# Altium project Temperature_Measurement_Device.PrjPCB
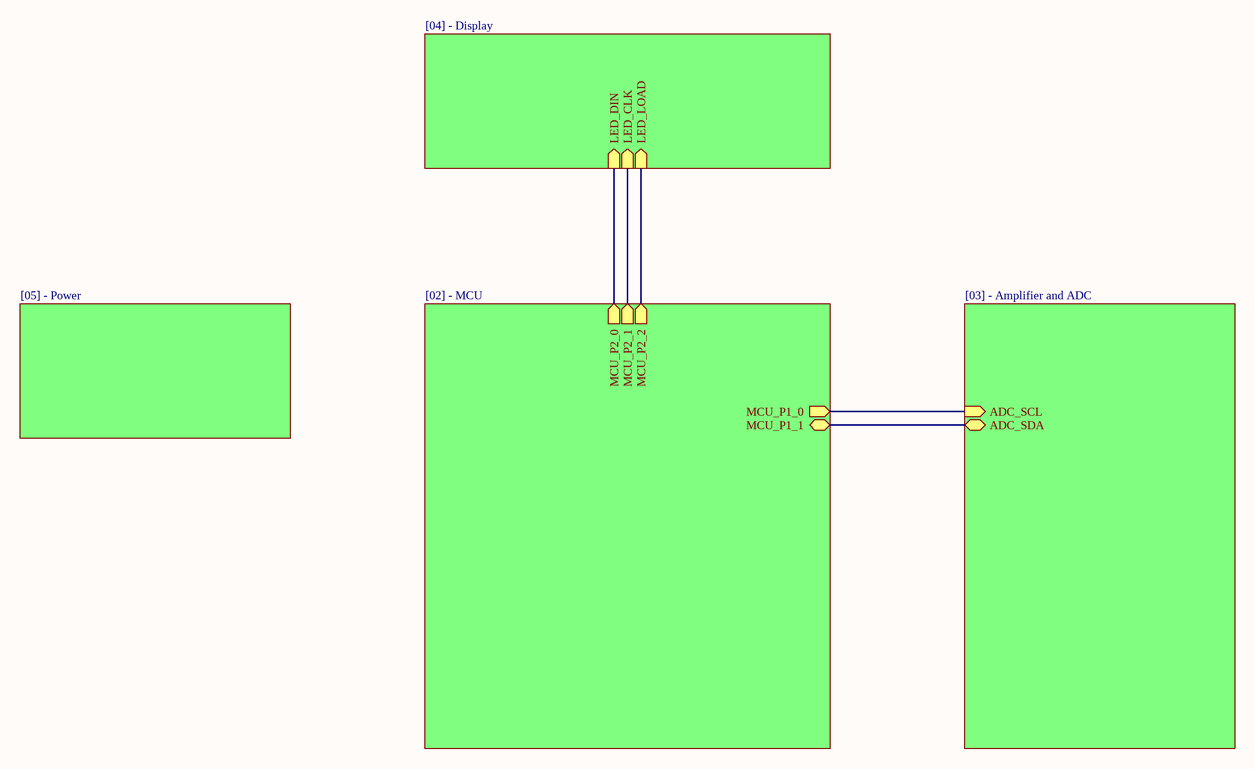
[diagram p0: [01] - SheetConnector.SchDoc]
5 sheets, 64 parts. Net scope: hierarchical (ports join the sheet entries above them; power ports are global).
Board file: Temperature_Measurement_Device.PcbDoc
Sheets:
  [01] - SheetConnector.SchDoc
    4 = [05] - Power.SchDoc
    2 = [02] - MCU.SchDoc
    1 = [04] - Display.SchDoc
    3 = [03] - Amplifier and ADC.SchDoc

## Sheet [01] - SheetConnector.SchDoc: =ProjectName
size A4; CheckedBy: Ven; Author: Ven; CompanyName: HUST; Revision: V.1.0

### Sub-sheets
1 = [04] - Display: LED_DIN (in), LED_CLK (in), LED_LOAD (in)
2 = [02] - MCU: MCU_P2_1 (out), MCU_P2_0 (out), MCU_P2_2 (out), MCU_P1_0 (out), MCU_P1_1 (bidir)
3 = [03] - Amplifier and ADC: ADC_SCL (in), ADC_SDA (bidir)
4 = [05] - Power: no entries

### Nets
NetIC1_1: sheet 2/MCU_P1_0, sheet 3/ADC_SCL
NetIC1_2: sheet 2/MCU_P1_1, sheet 3/ADC_SDA
NetIC1_21: sheet 2/MCU_P2_0, sheet 1/LED_DIN
NetIC1_22: sheet 2/MCU_P2_1, sheet 1/LED_CLK
NetIC1_23: sheet 2/MCU_P2_2, sheet 1/LED_LOAD

### Notes on the sheet
- Project:
- Page Contents:
- Size:
- Date:
- A4
- Checked by:
- Time:
- Revision:
- Sheet
- of
- File:

## Sheet [05] - Power.SchDoc: =ProjectName
size A4; CheckedBy: Ven; Author: Ven; CompanyName: HUST; Revision: V.1.0
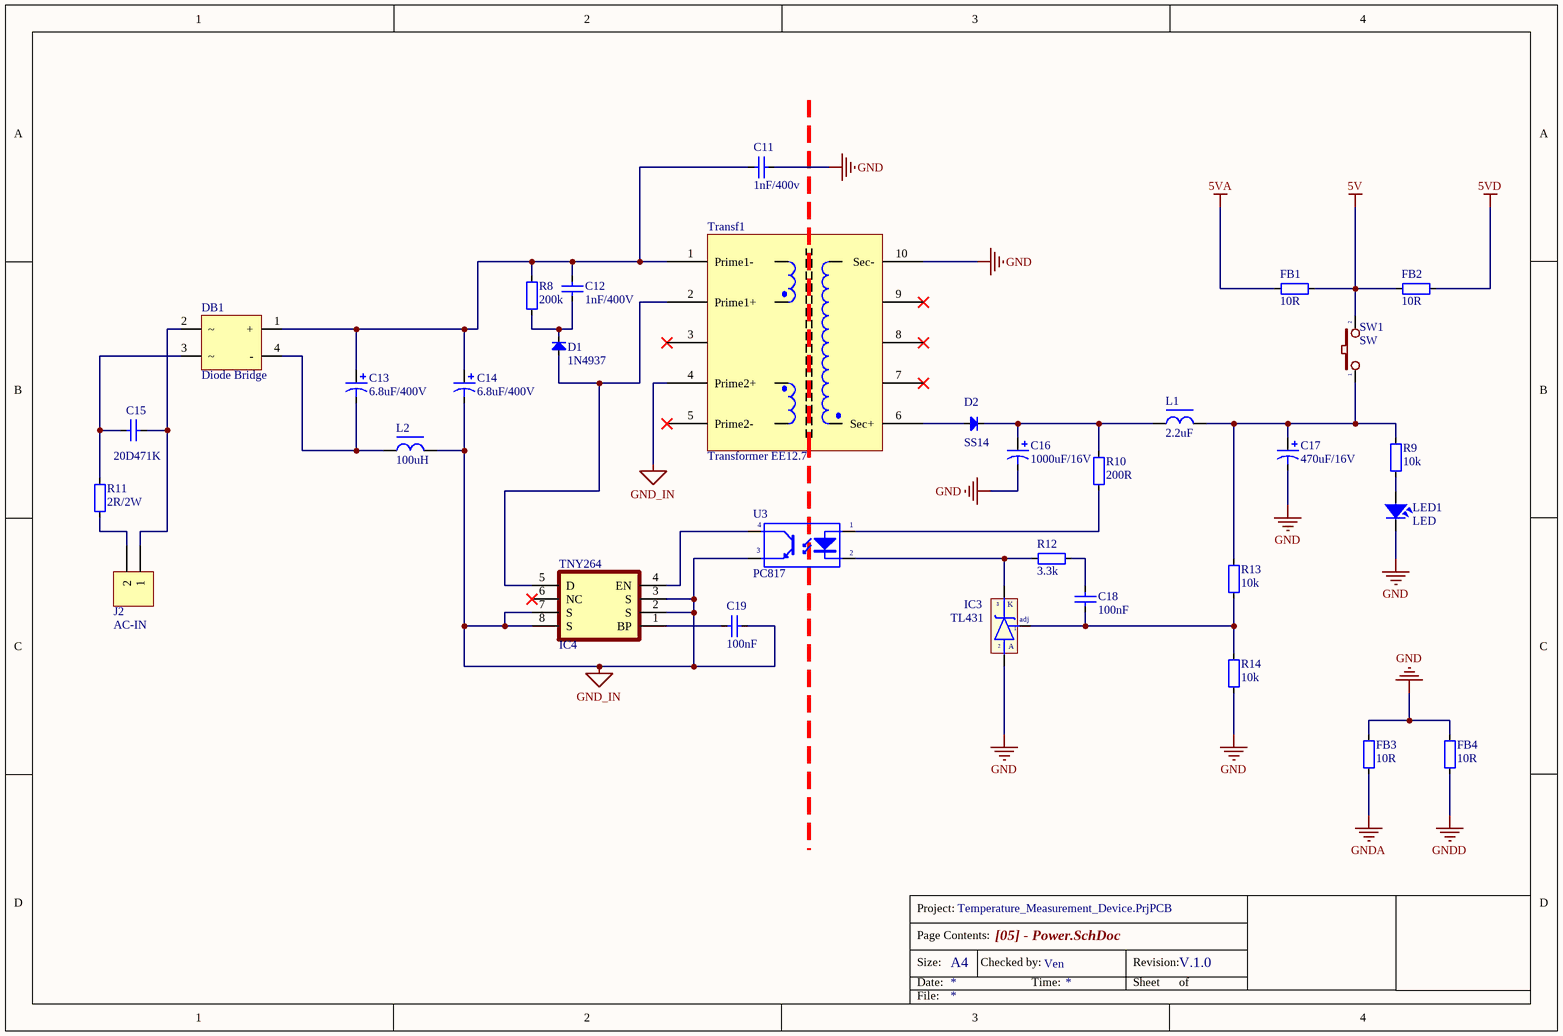
[diagram p1: [05] - Power.SchDoc]

### Parts
C11  1nF/400v  [103/2KV]
C12  1nF/400V  [103/2KV]
C13  6.8uF/400V  [C8mm]
C14  6.8uF/400V  [C8mm]
C15  20D471K  [103/2KV]
C16  1000uF/16V  [C8mm]
C17  470uF/16V  [C8mm]
C18  100nF  [CAP_0805]
C19  100nF  [CAP_0805]
D1  1N4937  [DIO-1AN]
D2  SS14  [DO-214AC(SMA)]
DB1  Diode Bridge  [DB207S]
FB1  10R  [RES-SMD-0805]
FB2  10R  [RES-SMD-0805]
FB3  10R  [RES-SMD-0805]
FB4  10R  [RES-SMD-0805]
IC3  TL431  [qto-92]
IC4  TNY264  [DIP8]
J2  AC-IN  [KF2-5.08]
L1  2.2uF  [L-SMD-M-7.3x4.5]
L2  100uH  [L-DIP-M-9.5x6]
LED1  LED  [LED-0805-Red]
R8  200k  [RES-1/4WD]
R9  10k  [RES-SMD-0805]
R10  200R  [RES-SMD-0805]
R11  2R/2W  [RES-1WD]
R12  3.3k  [RES-SMD-0805]
R13  10k  [RES-SMD-0805]
R14  10k  [RES-SMD-0805]
SW1  SW  [SW2]
Transf1  Transformer EE12.7  [Transformer EE12.7]
U3  PC817  [DIP4/W0.3]

### Nets
5V: FB1.2 FB2.1 SW1.2
5VA: FB1.1
5VD: FB2.2
GND: C11.1 C16.2 C17.2 FB3.2 FB4.2 IC3.2(A) LED1.2 R14.2 Transf1.10(Sec-)
GND_IN: C14.2 C19.1 IC4.2(S) IC4.3(S) IC4.7(S) IC4.8(S) L2.2 Transf1.4(Prime2+) U3.3(E)
GNDA: FB3.1
GNDD: FB4.1
NetC11_2: C11.2 C12.1 C13.1 C14.1 DB1.1(+) R8.2 Transf1.1(Prime1-)
NetC12_2: C12.2 D1.2(K) R8.1
NetC13_2: C13.2 DB1.4(-) L2.1
NetC15_1: C15.1 DB1.2 J2.1
NetC15_2: C15.2 DB1.3 R11.1
NetC16_1: C16.1 D2.2(K) L1.1 R10.1
NetC17_1: C17.1 L1.2 R9.1 R13.1 SW1.1
NetC18_1: C18.1 IC3.1(adj) R13.2 R14.1
NetC18_2: C18.2 R12.2
NetC19_2: C19.2 IC4.1(BP)
NetD1_1: D1.1(A) IC4.5(D) Transf1.2(Prime1+)
NetD2_1: D2.1(A) Transf1.6(Sec+)
NetIC3_3: IC3.3(K) R12.1 U3.2(K)
NetIC4_4: IC4.4(EN) U3.4(C)
NetJ2_2: J2.2 R11.2
NetLED1_1: LED1.1 R9.2
NetR10_2: R10.2 U3.1(A)

Not connected (* = marked no-connect by the designer): IC4 6(NC)*; Transf1 3* 5(Prime2-)* 7* 8* 9*

### Notes on the sheet
- Project:
- Page Contents:
- Size:
- Date:
- A4
- Checked by:
- Time:
- Revision:
- Sheet
- of
- File:

### Library data of the parts
C11 C12 = Cap2KV: CAP CERAMIC; Published: 8-Jun-2000; LatestRevisionDate: 17-Jul-2002; LatestRevisionNote: Re-released for DXP Platform.; PackageReference: RAD-0.3; Publisher: Altium Limited
C13 C14 C16 C17 = Cap Pol: Polarized Capacitor (Axial); Published: 8-Jun-2000; LatestRevisionDate: 17-Jul-2002; LatestRevisionNote: Re-released for DXP Platform.; PackageReference: POLAR0.8; Publisher: Altium Limited
C15 = Cap2KV: Varistor; Published: 8-Jun-2000; LatestRevisionDate: 17-Jul-2002; LatestRevisionNote: Re-released for DXP Platform.; PackageReference: RAD-0.3; Publisher: Altium Limited
C18 C19 = CapSMD: Capacitor; Value: 33p; Published: 8-Jun-2000; LatestRevisionDate: 17-Jul-2002; LatestRevisionNote: Re-released for DXP Platform.; PackageReference: RAD-0.3; Publisher: Altium Limited
D1 = Diode SMD: Diode Schottky / 1N4937; Code - JEDEC: DO-214-AB; Value: 1N5007; Published: 8-Jun-2000; Revision: July-2002: Re-released for DXP Platform.; Publisher: Altium Limited
D2 = Diode SMD: Diode Schottky / 1N5819; Code - JEDEC: DO-214-AB; Value: 1N5007; Published: 8-Jun-2000; Revision: July-2002: Re-released for DXP Platform.; Publisher: Altium Limited
DB1 = Diode Bridge Flate
FB1-FB4 = Resistor - SMD: Ferrit Bead; Manufacturer: Generic Components; Class: Passive; Published: 08/06/2000; Publisher: Altium Hobart Technology Centre
IC3 = TL431: Programmable Shunt Regulator; Value: TL431
IC4 = TNY264: Enhanced, Energy Efficient, Low Power Off-line Switcher
J2 = KF2: Manufacturer: Würth Elektronik eiSos GmbH; partNo: 691103110002; ComponentLink1 Description: Manufacturer; ComponentLink2 Description: Datasheet; NoPins: 2; Created Date: 29 October 2013; ComponentLink1URL: http://www.we-online.com; ComponentLink2URL: http://katalog.we-online.de/em/datasheet/6911031100xx.pdf; Created by: Karrer Zheng
L1 L2 = L-DIP-1: Inductor; Value: 150 mH
LED1 = LED: LED Single colour Green and Red; Value: LED 3 ly Single Colour
R8-R14 = Resistor - SMD: Resistor; Manufacturer: Generic Components; Class: Passive; Published: 08/06/2000; Publisher: Altium Hobart Technology Centre
SW1 = SW2: Switch button 2 pin; Value: SW chip 2 pin
Transf1 = Tranformer EE16
U3 = PC817: Single Opto; Value: PC817

## Sheet [02] - MCU.SchDoc: =ProjectName
size A4; CheckedBy: Ven; Author: Ven; CompanyName: HUST; Revision: V.1.0
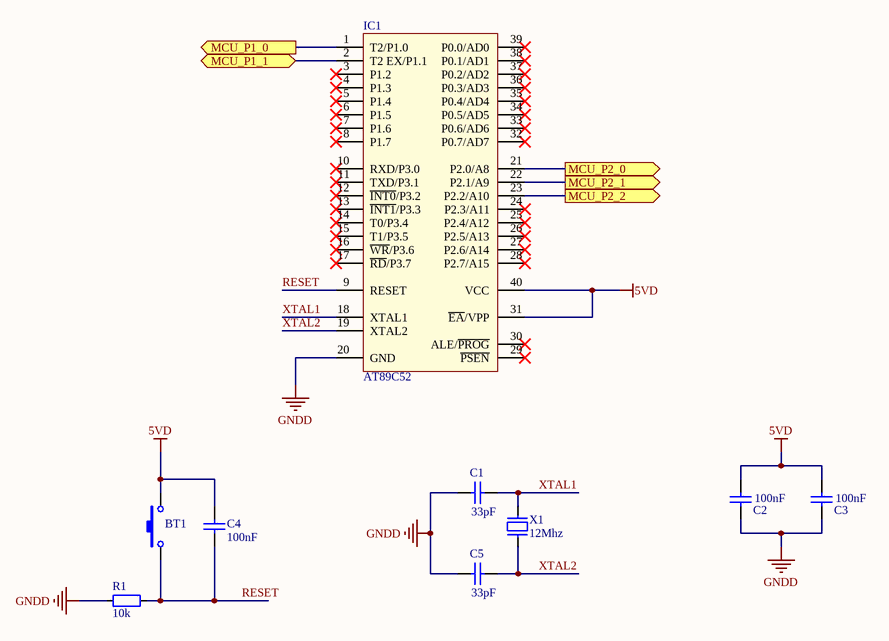
[diagram p2: [02] - MCU.SchDoc]

### Parts
BT1  SW2  [SW 3x2x4]  (value not drawn)
C1  33pF  [CAP_0805]
C2  100nF  [CAP_0805]
C3  100nF  [CAP_0805]
C4  100nF  [CAP_0805]
C5  33pF  [CAP_0805]
IC1  AT89C52  [DIP40/W0.6]
R1  10k  [RES-SMD-0805]
X1  12Mhz  [XT2]

### Ports
MCU_P1_0 (out), MCU_P1_1 (bidir), MCU_P2_0 (out), MCU_P2_1 (out), MCU_P2_2 (out)

### Nets
5VD: BT1.2 C2.2 C3.2 C4.2 IC1.31(~{EA}/VPP) IC1.40(VCC)
GNDD: C1.1 C2.1 C3.1 C5.1 IC1.20(GND) R1.2
RESET: BT1.1 C4.1 IC1.9(RESET) R1.1
XTAL1: C1.2 IC1.18(XTAL1) X1.1
XTAL2: C5.2 IC1.19(XTAL2) X1.2
NetIC1_1: IC1.1(T2/P1.0) ; port MCU_P1_0
NetIC1_2: IC1.2(T2_EX/P1.1) ; port MCU_P1_1
NetIC1_21: IC1.21(P2.0/A8) ; port MCU_P2_0
NetIC1_22: IC1.22(P2.1/A9) ; port MCU_P2_1
NetIC1_23: IC1.23(P2.2/A10) ; port MCU_P2_2

Not connected (* = marked no-connect by the designer): IC1 3(P1.2)* 4(P1.3)* 5(P1.4)* 6(P1.5)* 7(P1.6)* 8(P1.7)* 10(RXD/P3.0)* 11(TXD/P3.1)* 12(~{INT0}/P3.2)* 13(~{INT1}/P3.3)* 14(T0/P3.4)* 15(T1/P3.5)* 16(~{WR}/P3.6)* 17(~{RD}/P3.7)* 24(P2.3/A11)* 25(P2.4/A12)* 26(P2.5/A13)* 27(P2.6/A14)* 28(P2.7/A15)* 29(~{PSEN})* 30(ALE/~{PROG})* 32(P0.7/AD7)* 33(P0.6/AD6)* 34(P0.5/AD5)* 35(P0.4/AD4)* 36(P0.3/AD3)* 37(P0.2/AD2)* 38(P0.1/AD1)* 39(P0.0/AD0)*

### Notes on the sheet
- Project:
- Page Contents:
- Size:
- Date:
- A4
- Checked by:
- Time:
- Revision:
- Sheet
- of
- File:

### Library data of the parts
BT1 = Nut Nhan 2 Chan SMD: SMD; Don_Vi: Con; Ma_Hang: MH001036; Ten_Linh_Kien: Nút Nhấn 2 Chân 3x6x2.5MM SMD; Chung_Loai: Dán; Ghi_Chu: *; Kieu_Chan: *
C1 C4 C5 = CapCeramic: Capacitor; Published: 8-Jun-2000; LatestRevisionDate: 17-Jul-2002; LatestRevisionNote: Re-released for DXP Platform.; PackageReference: RAD-0.3; Publisher: Altium Limited
C2 C3 = CapSMD: Capacitor; Value: 33p; Published: 8-Jun-2000; LatestRevisionDate: 17-Jul-2002; LatestRevisionNote: Re-released for DXP Platform.; PackageReference: RAD-0.3; Publisher: Altium Limited
IC1 = AT89C52: Atmel AT89C52, 8k Byte Flash Memory , 40 Pin; Value: AT89C52
R1 = Resistor - SMD: as R8 on sheet [05] - Power; Published: 08/06/2000; Publisher: Altium Hobart Technology Centre
X1 = XT2: Crystal For all Crystal 2pin.; Value: 4Mhz

## Sheet [04] - Display.SchDoc: =ProjectName
size A4; CheckedBy: Ven; Author: Ven; CompanyName: HUST; Revision: V.1.0
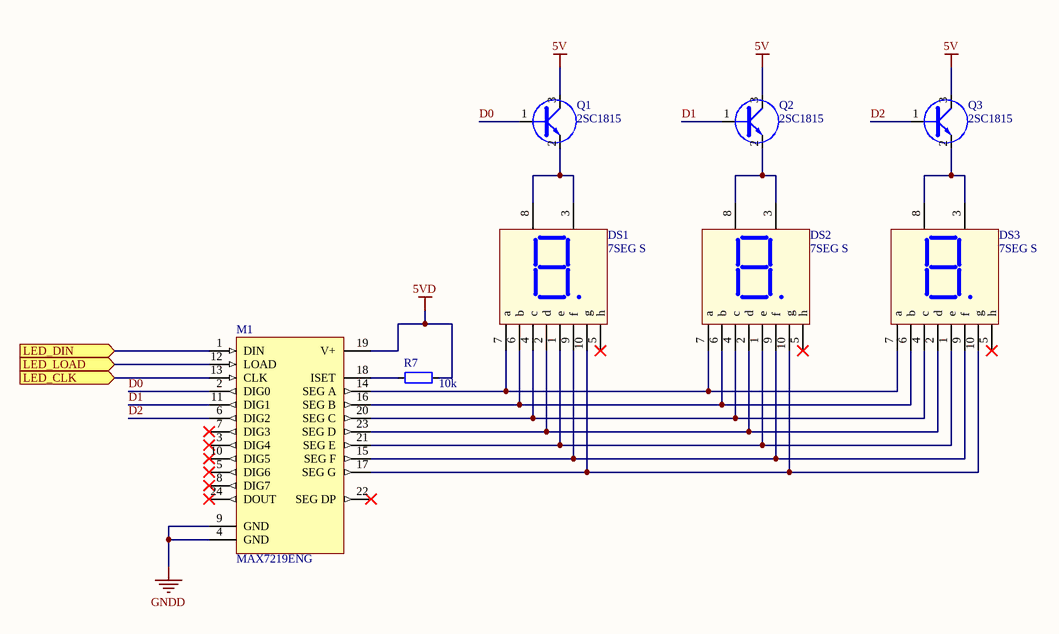
[diagram p3: [04] - Display.SchDoc]

### Parts
DS1  7SEG S  [7SEGS]
DS2  7SEG S  [7SEGS]
DS3  7SEG S  [7SEGS]
M1  MAX7219ENG  [DIP24/W0.3]
Q1  2SC1815  [SOT23D]
Q2  2SC1815  [SOT23D]
Q3  2SC1815  [SOT23D]
R7  10k  [RES-SMD-0805]

### Ports
LED_CLK (in), LED_DIN (in), LED_LOAD (in)

### Nets
5V: Q1.3(C) Q2.3(C) Q3.3(C)
5VD: M1.19(V+) R7.1
GNDD: M1.4(GND) M1.9(GND)
D0: M1.2(DIG0) Q1.1(B)
D1: M1.11(DIG1) Q2.1(B)
D2: M1.6(DIG2) Q3.1(B)
NetDS1_1: DS1.1(e) DS2.1(e) DS3.1(e) M1.21(SEG_E)
NetDS1_2: DS1.2(d) DS2.2(d) DS3.2(d) M1.23(SEG_D)
NetDS1_3: DS1.3(Vcc) DS1.8(Vcc) Q1.2(E)
NetDS1_4: DS1.4(c) DS2.4(c) DS3.4(c) M1.20(SEG_C)
NetDS1_6: DS1.6(b) DS2.6(b) DS3.6(b) M1.16(SEG_B)
NetDS1_7: DS1.7(a) DS2.7(a) DS3.7(a) M1.14(SEG_A)
NetDS1_9: DS1.9(f) DS2.9(f) DS3.9(f) M1.15(SEG_F)
NetDS1_10: DS1.10(g) DS2.10(g) DS3.10(g) M1.17(SEG_G)
NetDS2_3: DS2.3(Vcc) DS2.8(Vcc) Q2.2(E)
NetDS3_3: DS3.3(Vcc) DS3.8(Vcc) Q3.2(E)
NetIC1_21: M1.1(DIN) ; port LED_DIN
NetIC1_22: M1.13(CLK) ; port LED_CLK
NetIC1_23: M1.12(LOAD) ; port LED_LOAD
NetM1_18: M1.18(ISET) R7.2

Not connected (* = marked no-connect by the designer): DS1 5(h)*; DS2 5(h)*; DS3 5(h)*; M1 3(DIG4)* 5(DIG6)* 7(DIG3)* 8(DIG7)* 10(DIG5)* 22(SEG_DP)* 24(DOUT)*

### Notes on the sheet
- Project:
- Page Contents:
- Size:
- Date:
- A4
- Checked by:
- Time:
- Revision:
- Sheet
- of
- File:

### Library data of the parts
DS1-DS3 = LED7S: Single 7 Seg Dipslay; Value: LED 7S SEG
M1 = MAX7219ENG: Serially Interfaced, 8-Digit LED Display Driver; Published: 16-Jan-2001; LatestRevisionDate: 29-May-2009; LatestRevisionNote: Component Body Added.; DatasheetVersion: Jul-1997; PackageVersion: 1997; PackageReference: NG24A; Publisher: Altium Limited; PackageDescription: DIP, 24-Pin, Row Spacing 7.62 mm, Pitch 2.54 mm; Code_JEDEC: MS-001-AF; ComponentLink1Description: Manufacturer Link; ComponentLink1URL: http://www.maxim-ic.com/; ComponentLink2Description: Datasheet; ComponentLink2URL: http://pdfserv.maxim-ic.com/en/ds/MAX7219-MAX7221.pdf
Q1-Q3 = 2SC1815: NPN 600mW, ECB; Value: C1815
R7 = Resistor - SMD: as R8 on sheet [05] - Power; Published: 08/06/2000; Publisher: Altium Hobart Technology Centre

## Sheet [03] - Amplifier and ADC.SchDoc: =ProjectName
size A4; CheckedBy: Ven; Author: Ven; CompanyName: HUST; Revision: V.1.0
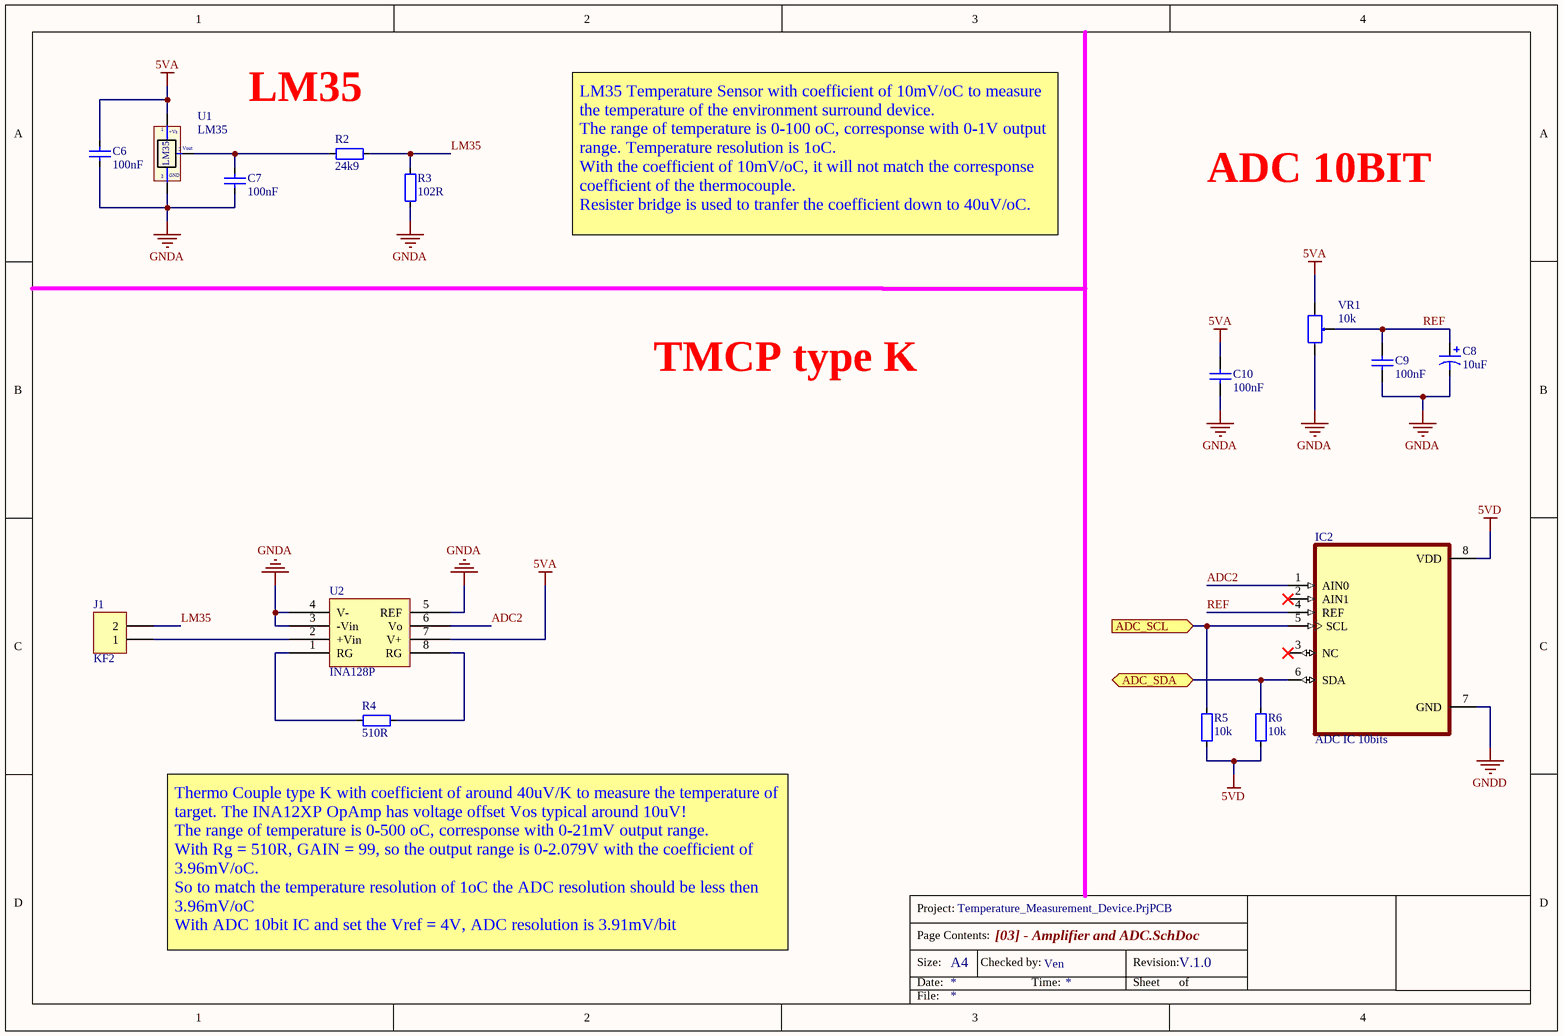
[diagram p4: [03] - Amplifier and ADC.SchDoc]

### Parts
C6  100nF  [CAP_0805]
C7  100nF  [CAP_0805]
C8  10uF  [C8mm]
C9  100nF  [CAP_0805]
C10  100nF  [CAP_0805]
IC2  ADC IC 10bits  [SOP - 8 µMAX]
J1  KF2  [KF2-5.08T]
R2  24k9  [RES-SMD-0805]
R3  102R  [RES-SMD-0805]
R4  510R  [RES-SMD-0805]
R5  10k  [RES-SMD-0805]
R6  10k  [RES-SMD-0805]
U1  LM35  [QTO-92]
U2  INA128P  [SOP-8]
VR1  10k  [VR]

### Ports
ADC_SCL (in), ADC_SDA (bidir)

### Nets
5VA: C6.2 C10.2 U1.1(+Vs) U2.7(V+) VR1.1
5VD: IC2.8(VDD) R5.1 R6.1
GNDA: C6.1 C7.1 C8.2 C9.1 C10.1 R3.1 U1.3(-) U2.3(-Vin) U2.4(V-) U2.5(REF) VR1.3
GNDD: IC2.7(GND)
ADC2: IC2.1(AIN0) U2.6(Vo)
LM35: J1.2 R2.1 R3.2
REF: C8.1 C9.2 IC2.4(REF) VR1.2
NetC7_2: C7.2 R2.2 U1.2(Vout)
NetIC1_1: IC2.5(SCL) R5.2 ; port ADC_SCL
NetIC1_2: IC2.6(SDA) R6.2 ; port ADC_SDA
NetJ1_1: J1.1 U2.2(+Vin)
NetR4_1: R4.1 U2.1(RG)
NetR4_2: R4.2 U2.8(RG)

Not connected (* = marked no-connect by the designer): IC2 2(AIN1)* 3(NC)*

### Notes on the sheet
- LM35
- ADC 10BIT
- LM35 Temperature Sensor with coefficient of 10mV/oC to measure the temperature of the environment surround device.
  The range of temperature is 0-100 oC, corresponse with 0-1V output range. Temperature resolution is 1oC.
  With the coefficient of 10mV/oC, it will not match the corresponse coefficient of the thermocouple.
  Resister bridge is used to tranfer the coefficient down to 40uV/oC.
- TMCP type K
- Thermo Couple type K with coefficient of around 40uV/K to measure the temperature of target. The INA12XP OpAmp has voltage offset Vos typical around 10uV!
  The range of temperature is 0-500 oC, corresponse with 0-21mV output range.
  With Rg = 510R, GAIN = 99, so the output range is 0-2.079V with the coefficient of 3.96mV/oC.
  So to match the temperature resolution of 1oC the ADC resolution should be less then 3.96mV/oC
  With ADC 10bit IC and set the Vref = 4V, ADC resolution is 3.91mV/bit
- Project:
- Page Contents:
- Size:
- Date:
- A4
- Checked by:
- Time:
- Revision:
- Sheet
- of
- File:
- (in symbol LM35) GND

### Library data of the parts
C6 C7 C9 C10 = CapSMD: Capacitor; Value: 33p; Published: 8-Jun-2000; LatestRevisionDate: 17-Jul-2002; LatestRevisionNote: Re-released for DXP Platform.; PackageReference: RAD-0.3; Publisher: Altium Limited
C8 = Cap Pol: Polarized Capacitor (Axial); Published: 8-Jun-2000; LatestRevisionDate: 17-Jul-2002; LatestRevisionNote: Re-released for DXP Platform.; PackageReference: POLAR0.8; Publisher: Altium Limited
IC2 = MAX11646
J1 = KF2: Couple Thermo type K; Manufacturer: Würth Elektronik eiSos GmbH; partNo: 691103110002; ComponentLink1 Description: Manufacturer; ComponentLink2 Description: Datasheet; NoPins: 2; Created Date: 29 October 2013; ComponentLink1URL: http://www.we-online.com; ComponentLink2URL: http://katalog.we-online.de/em/datasheet/6911031100xx.pdf; Created by: Karrer Zheng
R2-R6 = Resistor - SMD: as R8 on sheet [05] - Power; Published: 08/06/2000; Publisher: Altium Hobart Technology Centre
U1 = LM35: Teminal; Value: LM35
U2 = INA129PA: Instrumental Operate Amplifier
VR1 = VR: Var Resistor; Value: VR 10K

## Nets that join several sheets
5V: [05] - Power (FB1.2 FB2.1 SW1.2), [04] - Display (Q1.3 Q2.3 Q3.3)
5VA: [05] - Power (FB1.1), [03] - Amplifier and ADC (5 pins)
5VD: [05] - Power (FB2.2), [02] - MCU (6 pins), [04] - Display (M1.19 R7.1), [03] - Amplifier and ADC (IC2.8 R5.1 R6.1)
GNDA: [05] - Power (FB3.1), [03] - Amplifier and ADC (11 pins)
GNDD: [05] - Power (FB4.1), [02] - MCU (6 pins), [04] - Display (M1.4 M1.9), [03] - Amplifier and ADC (IC2.7)
NetIC1_1: [02] - MCU (IC1.1), [03] - Amplifier and ADC (IC2.5 R5.2)
NetIC1_2: [02] - MCU (IC1.2), [03] - Amplifier and ADC (IC2.6 R6.2)
NetIC1_21: [02] - MCU (IC1.21), [04] - Display (M1.1)
NetIC1_22: [02] - MCU (IC1.22), [04] - Display (M1.13)
NetIC1_23: [02] - MCU (IC1.23), [04] - Display (M1.12)